# Altium schematic sheet 2_Microcontroller.SchDoc: Microcontroller
size A4; DrawnBy: Cristian Oprea; Revision: 1; SheetNumber: 2; SheetTotal: 4
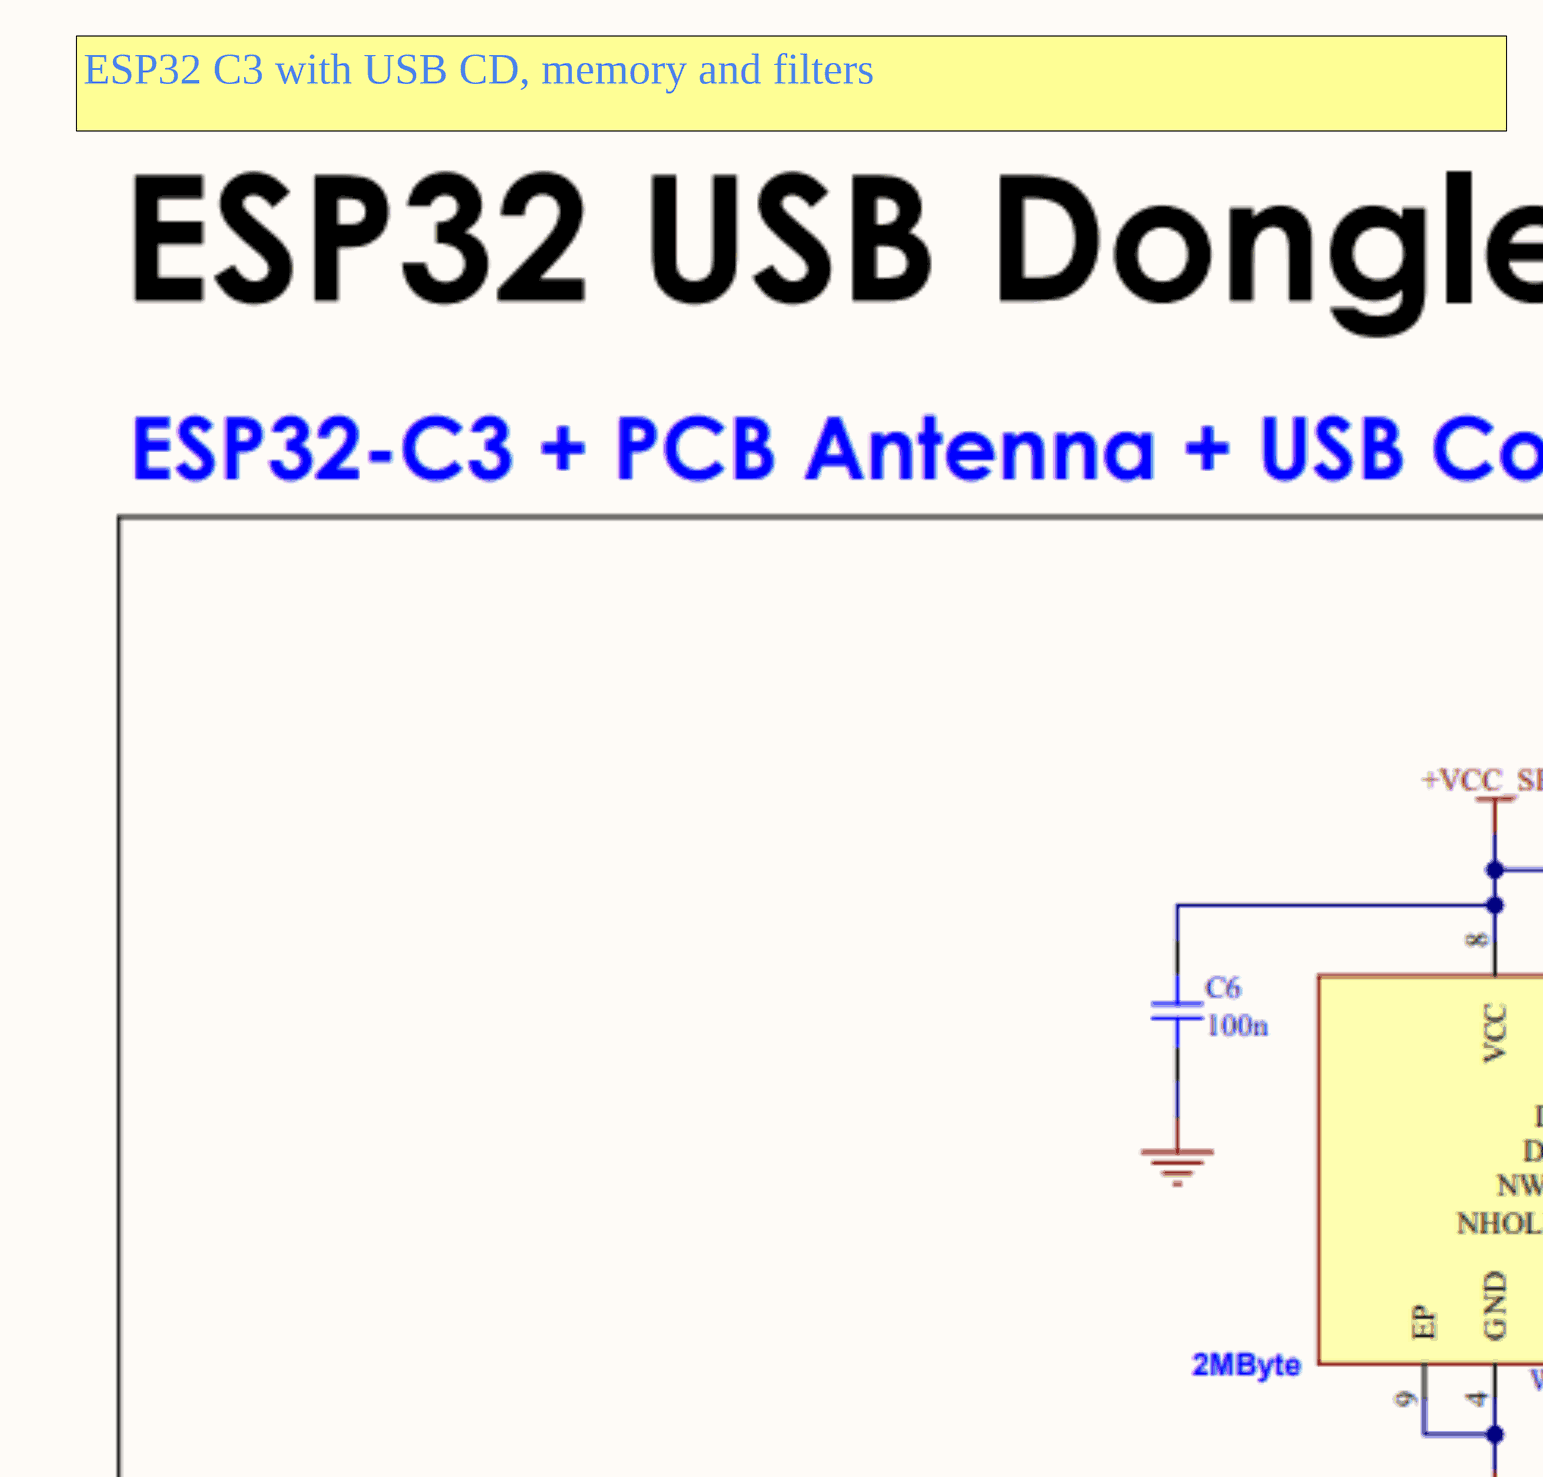
[diagram p0: 2_Microcontroller.SchDoc, top right]
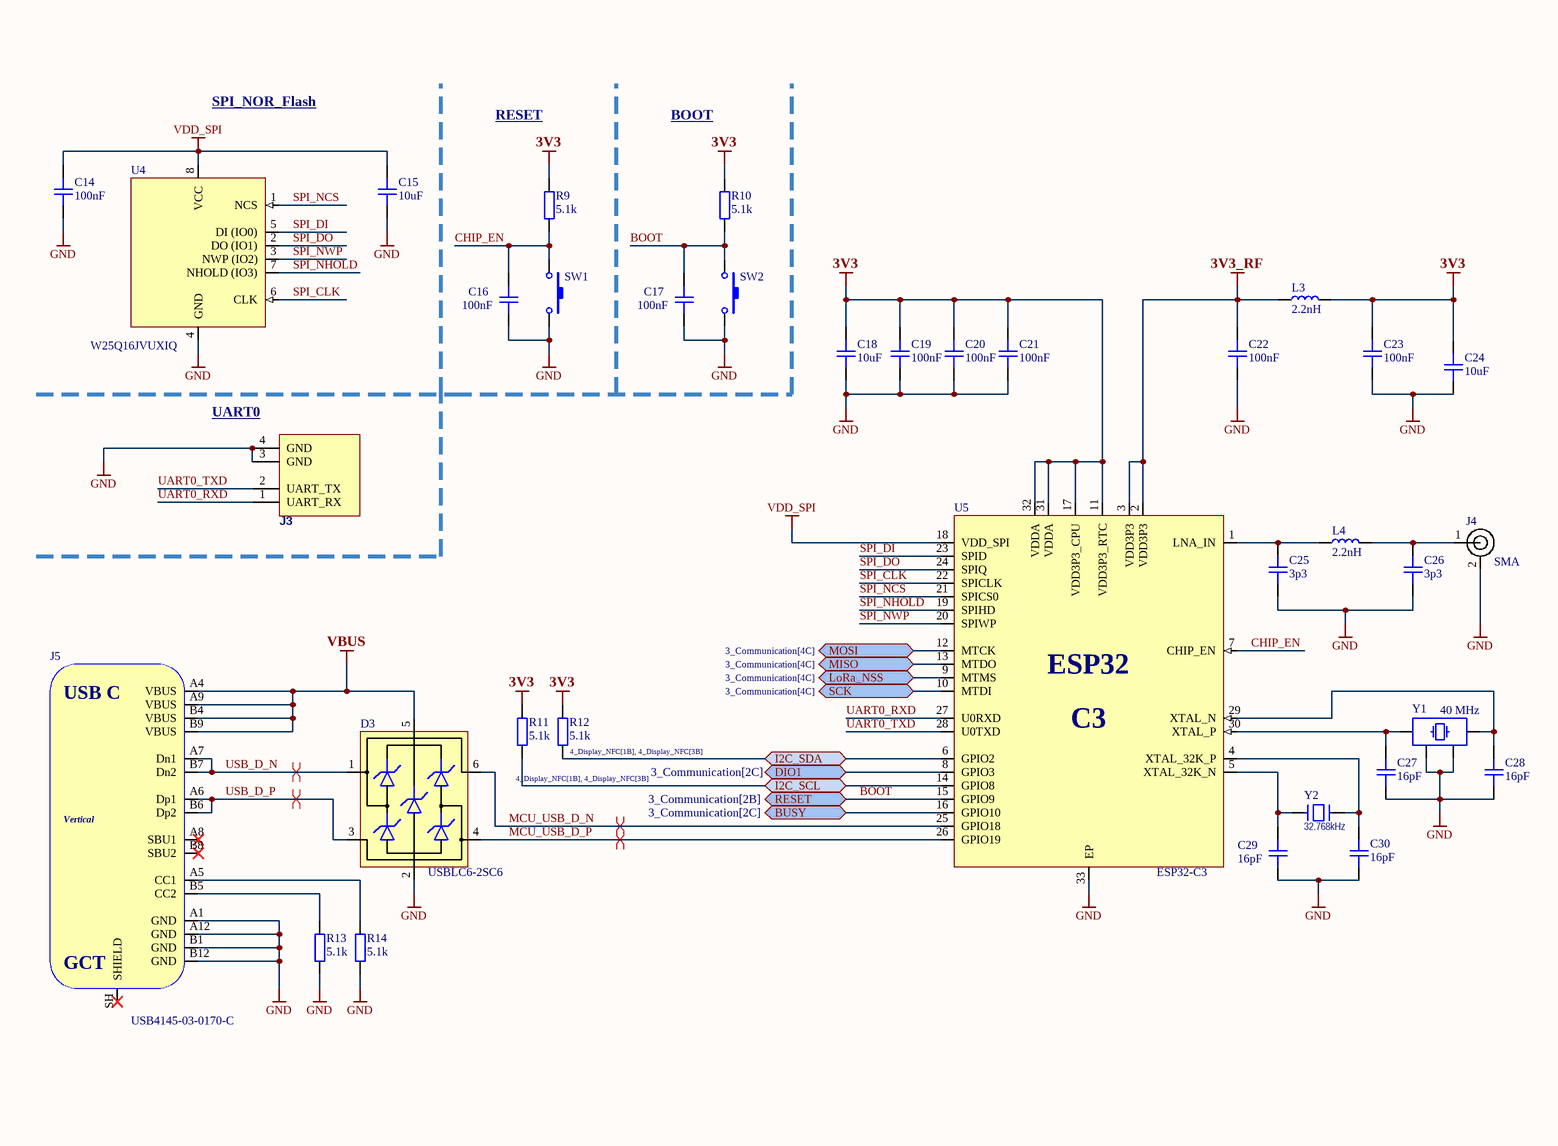
[diagram p1: 2_Microcontroller.SchDoc, bottom left]
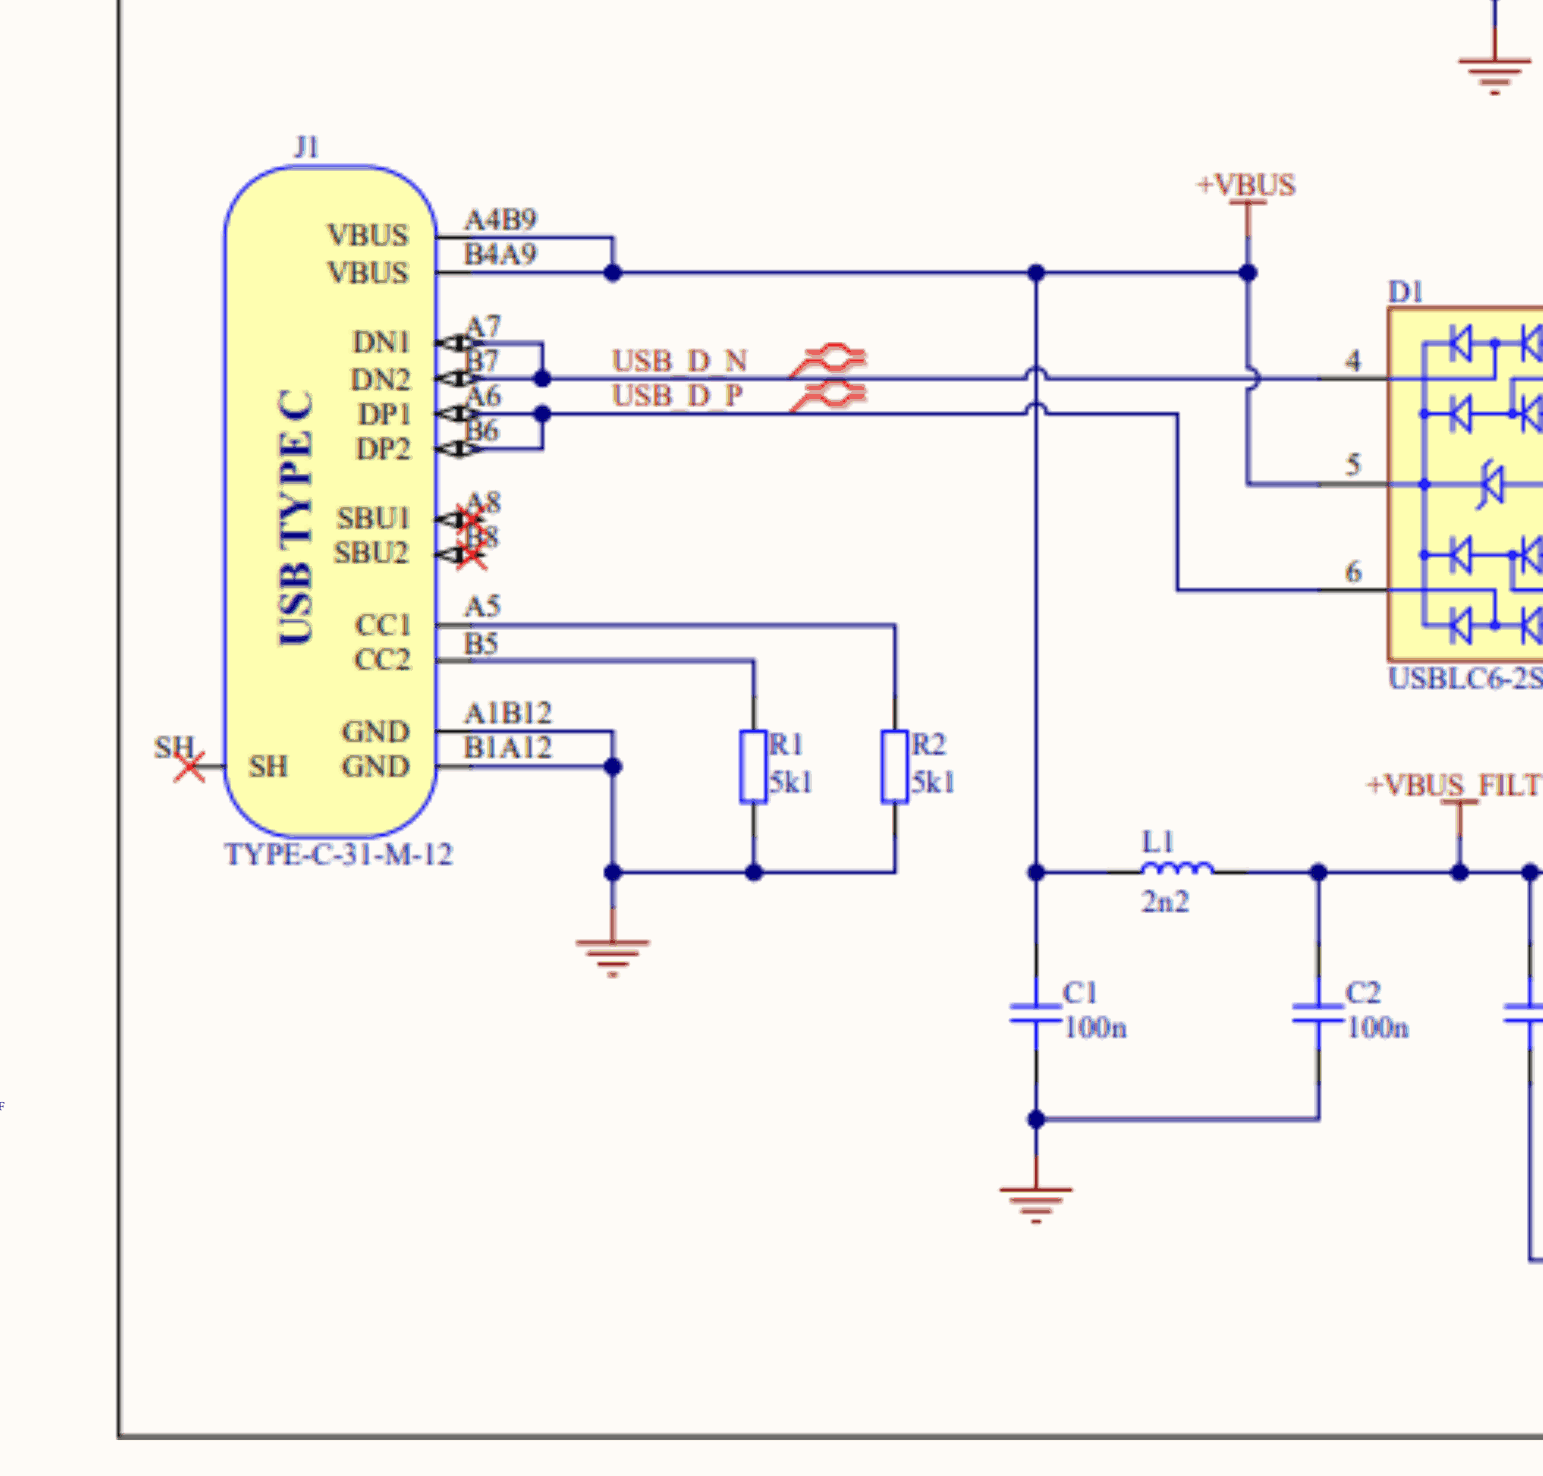
[diagram p2: 2_Microcontroller.SchDoc, bottom right]

## Parts
C14  100nF  [C0603]
C15  10uF  [C0805]
C16  100nF  [C0603]
C17  100nF  [C0603]
C18  10uF  [C0805]
C19  100nF  [C0603]
C20  100nF  [C0603]
C21  100nF  [C0603]
C22  100nF  [C0603]
C23  100nF  [C0603]
C24  10uF  [C0805]
C25  3p3  [C0603]
C26  3p3  [C0603]
C27  16pF  [C0603]
C28  16pF  [C0603]
C29  16pF  [C0603]
C30  16pF  [C0603]
D3  USBLC6-2SC6  [SOT23-6]
J3  Header1x4  [HEADER_2x2_2.54]  (value not drawn)
J4  SMA  [CON_SMA-EDGE-S]
J5  USB4145-03-0170-C  [VALCON_CSP-USC16-TR]
L3  2.2nH  [L0603]
L4  2.2nH  [L0603]
R9  5.1k  [R0603]
R10  5.1k  [R0603]
R11  5.1k  [R0603]
R12  5.1k  [R0603]
R13  5.1k  [R0603]
R14  5.1k  [R0603]
SW1  PTS645SM43SMTR92 LFS  [SW_SKRPACE010]  (value not drawn)
SW2  PTS645SM43SMTR92 LFS  [SW_SKRPACE010]  (value not drawn)
U4  W25Q16JVUXIQ  [SOIC-8N_208mil]
U5  ESP32-C3  [QFN-32-5x5x0.85mm]
Y1  40 MHz  [CRYSTAL_ECX-32_3.2x2.5x0.8 - duplicate]
Y2  32.768kHz  [CRYSTAL_SX-3215]

## Ports
BUSY (bidir, see 3_Communication[2C]), DIO1 (bidir, see 3_Communication[2C]), I2C_SCL (bidir, see 4_Display_NFC[1B], 4_Display_NFC[3B]), I2C_SDA (bidir, see 4_Display_NFC[1B], 4_Display_NFC[3B]), LoRa_NSS (bidir, see 3_Communication[4C]), MISO (bidir, see 3_Communication[4C]), MOSI (bidir, see 3_Communication[4C]), RESET (bidir, see 3_Communication[2B]), SCK (bidir, see 3_Communication[4C])

## Nets
3V3: C18.2 C19.2 C20.2 C21.2 C23.2 C24.2 L3.2 R9.2 R10.2 R11.2 R12.2 U5.11(VDD3P3_RTC) U5.17(VDD3P3_CPU) U5.31(VDDA) U5.32(VDDA)
3V3_RF: C22.2 L3.1 U5.2(VDD3P3) U5.3(VDD3P3)
GND: C14.1 C15.1 C16.1 C17.1 C18.1 C19.1 C20.1 C21.1 C22.1 C23.1 C24.1 C25.1 C26.1 C27.1 C28.1 C29.1 C30.1 D3.2(GND) J3.3(GND) J3.4(GND) J4.2 J5.A1(GND) J5.A12(GND) J5.B1(GND) J5.B12(GND) R13.1 R14.1 SW1.2 SW2.2 U4.4(GND) U5.33(EP) Y1.2 Y1.4
VBUS: D3.5(VBUS) J5.A4(VBUS) J5.A9(VBUS) J5.B4(VBUS) J5.B9(VBUS)
VDD_SPI: C14.2 C15.2 U4.8(VCC) U5.18(VDD_SPI)
BOOT: C17.2 R10.1 SW2.1 U5.15(GPIO9) ; port RESET
BUSY: U5.16(GPIO10) ; port BUSY
CHIP_EN: C16.2 R9.1 SW1.1 U5.7(CHIP_EN)
DIO1: U5.8(GPIO3) ; port DIO1
I2C_SCL: R11.1 U5.14(GPIO8) ; port I2C_SCL
I2C_SDA: R12.1 U5.6(GPIO2) ; port I2C_SDA
LoRa_NSS: U5.9(MTMS) ; port LoRa_NSS
MCU_USB_D_N: D3.6(IO1) U5.25(GPIO18)
MCU_USB_D_P: D3.4(IO2) U5.26(GPIO19)
MISO: U5.13(MTDO) ; port MISO
MOSI: U5.12(MTCK) ; port MOSI
SCK: U5.10(MTDI) ; port SCK
SPI_CLK: U4.6(CLK) U5.22(SPICLK)
SPI_DI: U4.5(DI_(IO0)) U5.23(SPID)
SPI_DO: U4.2(DO_(IO1)) U5.24(SPIQ)
SPI_NCS: U4.1(NCS) U5.21(SPICS0)
SPI_NHOLD: U4.7(NHOLD_(IO3)) U5.19(SPIHD)
SPI_NWP: U4.3(NWP_(IO2)) U5.20(SPIWP)
UART0_RXD: J3.1(UART_RX) U5.27(U0RXD)
UART0_TXD: J3.2(UART_TX) U5.28(U0TXD)
USB_D_N: D3.1(IO1) J5.A7(Dn1) J5.B7(Dn2)
USB_D_P: D3.3(IO2) J5.A6(Dp1) J5.B6(Dp2)
NetC25_2: C25.2 L4.1 U5.1(LNA_IN)
NetC26_2: C26.2 J4.1 L4.2
NetC27_2: C27.2 U5.30(XTAL_P) Y1.1
NetC28_2: C28.2 U5.29(XTAL_N) Y1.3
NetC29_2: C29.2 U5.5(XTAL_32K_N) Y2.2
NetC30_2: C30.2 U5.4(XTAL_32K_P) Y2.1
NetJ5_A5: J5.A5(CC1) R14.2
NetJ5_B5: J5.B5(CC2) R13.2

Not connected (* = marked no-connect by the designer): J5 A8(SBU1)* B8(SBU2)* SH(SHIELD)*

## Layout directives
differential pair: MCU_USB_D_N, MCU_USB_D_P, USB_D_N, USB_D_P

## Notes on the sheet
- ESP32 C3 with USB CD, memory and filters
- SPI_NOR_Flash
- RESET
- BOOT
- (near J3) UART0
- can be used for debug/programming
- (in symbol ESP32-C3) ESP32; C3
- (in symbol USB4145-03-0170-C) USB C; Vertical

## Library data of the parts
C14 C16 C17 C19-C23 C25-C30 = CAP_0603: Capacitor SMD 0603; Manufacturer: *; Manufacturer Part Number: *; Distributor Link: *; LCSC: *; Rating: *; Dielectric: *
C15 C18 C24 = CAP_0805: Capacitor SMD 0805; Manufacturer: *; Manufacturer Part Number: *; Distributor Link: *; LCSC: *; Rating: *; Dielectric: *
D3 = USBLC6-2SC6: Low-Capacitance ESD Protection USB; Manufacturer: STMicroelectronics; Manufacturer Part Number: USBLC6-2SC6; Distributor Link: https://www.mouser.de/ProductDetail/STMicroelectronics/USBLC6-2SC6?qs=po45yt2pPpu%2FhNIlwQdTlg%3D%3D
J3 = Header1x4: *; PackageReference: *; Manufacturer Part Number 1: *
J4 = CON-SMA-EDGE-S: RF Connector SMA Female 50 Ohms 18 GHz PCB Edge Mount; Manufacturer: RF Solutions; Manufacturer Part Number: CON-SMA-EDGE-S
J5 = USB4145-03-0170-C: USB Connector Type C SMT 16 Pin Vertical; Manufacturer: GCT; Manufacturer Part Number: USB4145-03-0170-C
L3 L4 = IND_1008: Inductor SMD 1008
R9-R14 = RES_0603: Resistor SMD 0603; Manufacturer: *; Manufacturer Part Number: *; Distributor Link: *; LCSC: *
SW1 SW2 = SW-PB: Switch; Published: 24-Mar-1999; LatestRevisionDate: 17-Jul-2002; LatestRevisionNote: Re-released for DXP Platform.; Publisher: Altium Limited; PackageDescription: Switch; 2 Leads; Manufacturer Part Number 1: PTS645SM43SMTR92 LFS; PackageReference: SW-PB
U4 = W25Q16JVUXIQ: 16M-BIT SERIAL FLASH MEMORY WITH DUAL/QUAD SPI USON-8; Manufacturer: Winbond; Manufacturer Part Number: W25Q16JVUXIQ; LCSC: C2843335
U5 = ESP32-C3: Ultra­Low­Power SoC with RISC­V Single­Core CPU Supporting IEEE 802.11b/g/n (2.4 GHz Wi­Fi) and Bluetooth® 5 (LE); Manufacturer: Espressif; Manufacturer Part Number: ESP32-C3; LCSC: C2838500
Y1 = XTAL_2016: Crystal SMD 4-Pin 3225x4; Distributor Link: *
Y2 = CRYSTAL_1: Crystal; Manufacturer Part Number 1: *; PackageReference: SX-3215